# Altium schematic sheet 0805_R300.schdoc
size 49 x 27 mm
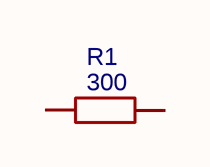
[diagram p0: 0805_R300.schdoc]

## Parts
R1  300  [R0805]

## Nets

Not connected (* = marked no-connect by the designer): R1 1 2

## Library data of the parts
R1 = 300: BOM_Manufacturer: ResistorToday; BOM_Manufacturer Part: AECR0805F300RK9; nameAlias: Resistance (Ohms); Contributor: LCSC; BOM_Supplier: LCSC; BOM_Supplier Part: C352224; spicePre: R; spiceSymbolName: AECR0805F300RK9